# EAGLE design CAN-FD Shield (EAGLE 6.4)
DESCRIPTION: microOBD 200 OBD-II Module; HW_REV: 1.4; PCB_REV: C; PCB_SPEC1: Layer Count: 4; PCB_SPEC2: Size: 1.3" x 0.59"; PCB_SPEC3: Finish Thickness: 0.049" - 0.052"; PCB_SPEC4: Copper Weight: 1oz; TITLE: STM1120

## Sheet 1 of 2
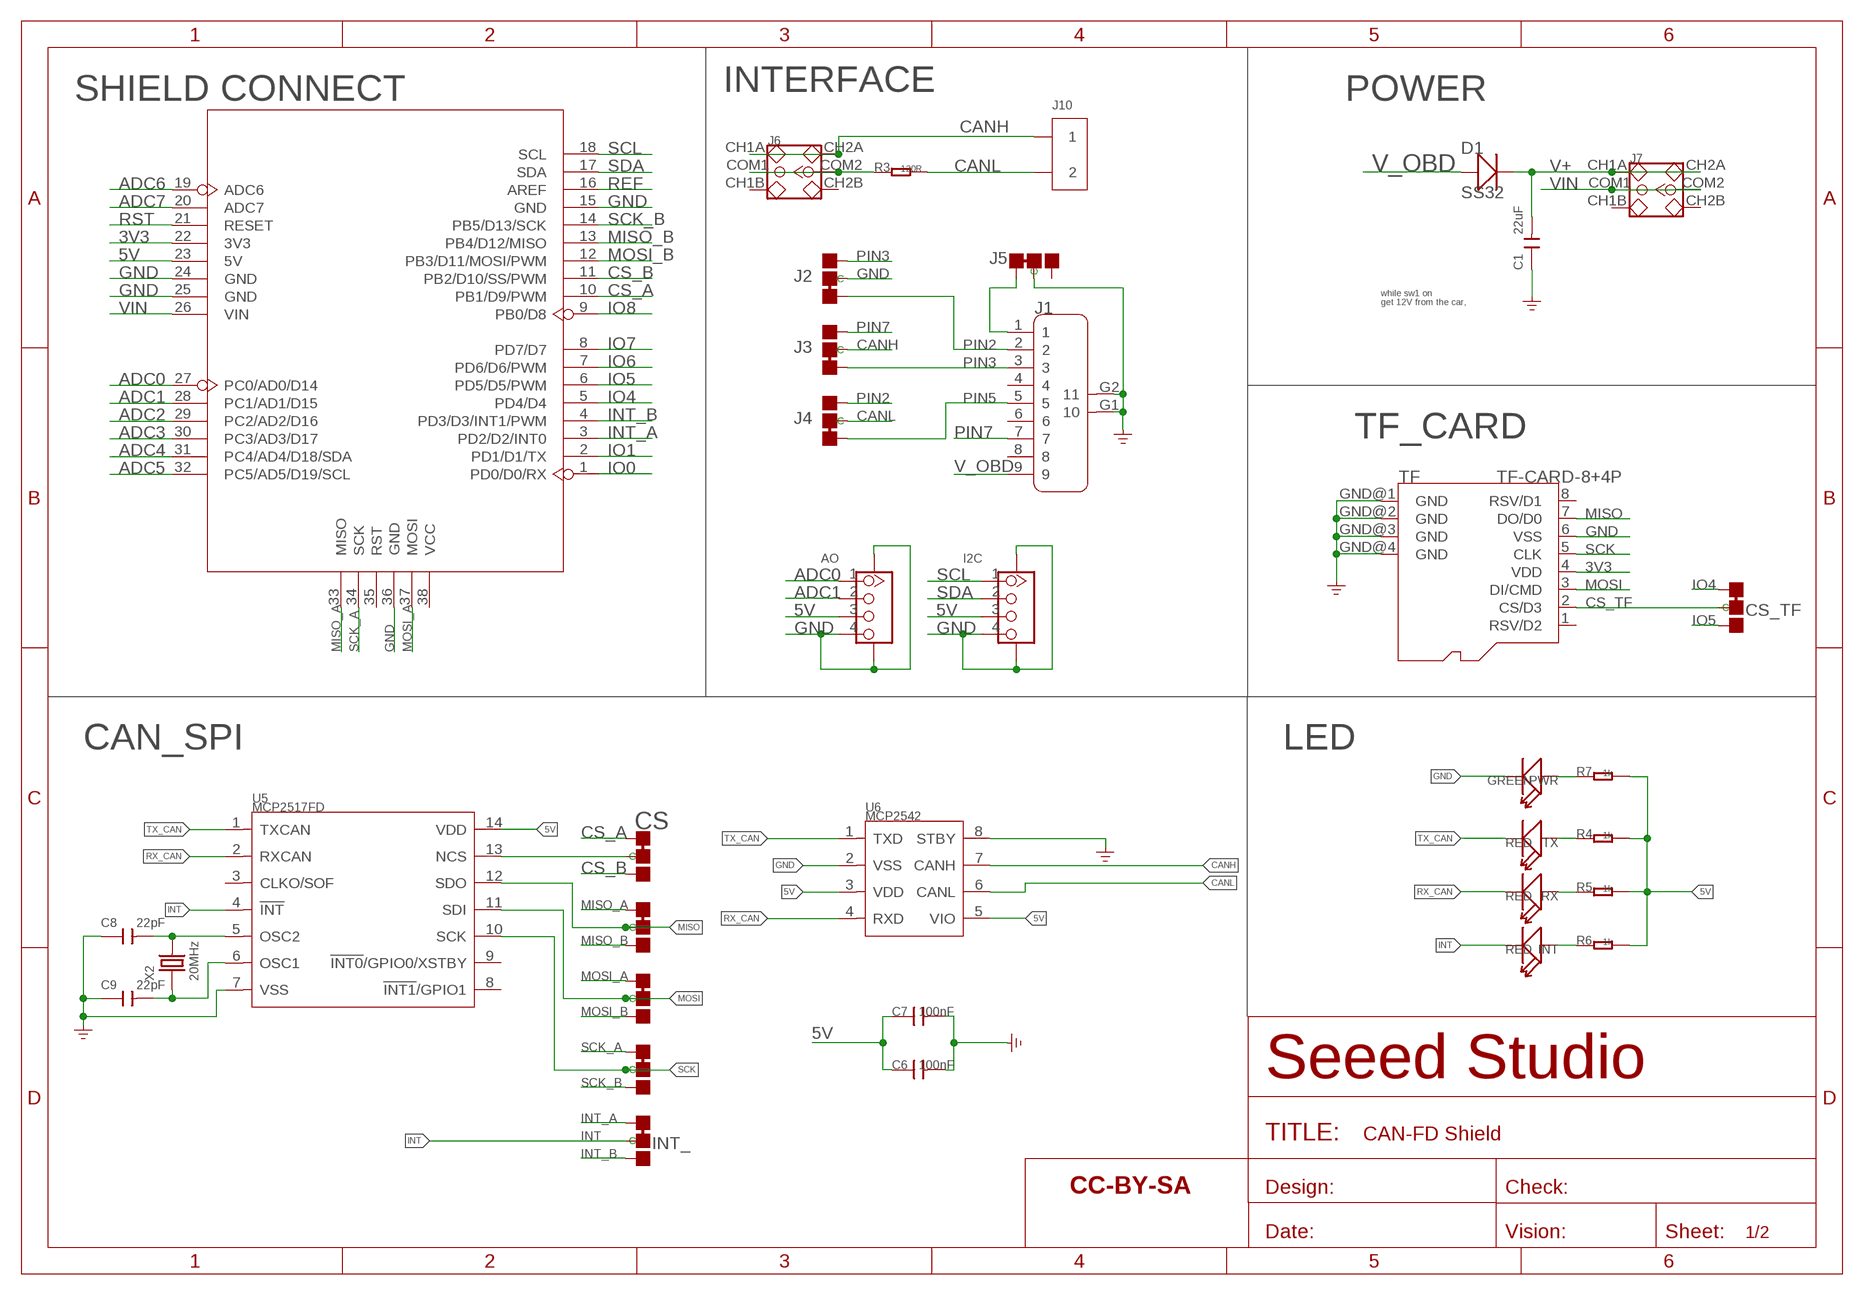
[diagram p0: schematic, sheet 1]

### Parts
AO  GROVE-CONNECTOR-SMD'90D'  [HW4-SMD-2.0-90D]
C1  22uF  CAP-1206  [C1206]
C6  100nF  C-0603  [0603]
C7  100nF  C-0603  [0603]
C8  22pF  CAP-0603  [C0603]
C9  22pF  CAP-0603  [C0603]
CS  JUMPER-3P-SHORT  [3P-SMD-SHORT]
CS_TF  JUMPER-3P-SHORT  [3P-SMD-SHORT]
D1  SS32  D-SMA  [D2010]
I2C  GROVE-CONNECTOR-SMD'90D'  [HW4-SMD-2.0-90D]
INT  RED  LED'0603'  [LED-0603]
INT_  JUMPER-3P-SHORT  [3P-SMD-SHORT]
J1  DB9'MEAL'  [DB9-MEAL]
J2  JUMPER-3P-SHORT  [3P-SMD-SHORT]
J3  JUMPER-3P-SHORT  [3P-SMD-SHORT]
J4  JUMPER-3P-SHORT  [3P-SMD-SHORT]
J5  JUMPER-3P-SHORT  [3P-SMD-SHORT]
J6  SWITCH-2CH-6P  [6P-2CH-2.54-7.6X3.0]
J7  SWITCH-2CH-6P  [6P-2CH-2.54-7.6X3.0]
J10  SCREW-TERMINAL-2P'5.08'  [H2-5.0-10.5X8.0MM]
MISO  JUMPER-3P-SHORT  [3P-SMD-SHORT]
MOSI  JUMPER-3P-SHORT  [3P-SMD-SHORT]
PWR  GREEN  LED'0603'  [LED-0603]
R3  120R  R-0603  [0603]
R4  1k  R-0603  [0603]
R5  1k  R-0603  [0603]
R6  1k  R-0603  [0603]
R7  1k  R-0603  [0603]
RX  RED  LED'0603'  [LED-0603]
SCK  JUMPER-3P-SHORT  [3P-SMD-SHORT]
TF  TF-CARD-8+4P  [TF-8+4P-1.1-13.5X15MM]
TX  RED  LED'0603'  [LED-0603]
U4  ARDUINO-38P'WITH/-SILK'  [ARDUINO-38P-WITH/-SILK-500519002]
U5  MCP2517FD  CONTROLLER-MCP2517FD  [SOIC14-1.27-8.6X3.9MM]
U6  MCP2542  TRANSCEIVER-MCP2542  [SOIC8-1.27-5X4MM]
U$5  SEEEDSTUDIO-OPEN-SCH-FRAME  [SEEEDSTUDIO-PCB-FRAME]
X2  20MHz  CRYSTAL-2P'HC49US'  [HC49US]

### Nets
3V3: TF.4(VDD) U4.22(3V3)
5V: AO.3 C6.1 C7.1 I2C.3 R4.2 R5.2 R6.2 R7.2 U4.23(5V) U5.14(VDD) U6.3(VDD) U6.5(VIO)
ADC0: AO.1 U4.27(PC0/AD0/D14)
ADC1: AO.2 U4.28(PC1/AD1/D15)
ADC2: U4.29(PC2/AD2/D16)
ADC3: U4.30(PC3/AD3/D17)
ADC4: U4.31(PC4/AD4/D18/SDA)
ADC5: U4.32(PC5/AD5/D19/SCL)
ADC6: U4.19(ADC6)
ADC7: U4.20(ADC7)
CANH: J3.MM(C) J6.CH1A J6.CH2A J10.1 U6.7(CANH)
CANL: J4.MM(C) J10.2 R3.2 U6.6(CANL)
CS_A: CS.11(L) U4.10(PB1/D9/PWM)
CS_B: CS.00(R) U4.11(PB2/D10/SS/PWM)
CS_TF: CS_TF.MM(C) TF.2(CS/D3)
GND: AO.4 AO.SS1 AO.SS2 C1.1 C6.2 C7.2 C8.1 C9.1 I2C.4 I2C.SS1 I2C.SS2 J1.G1 J1.G2 J2.MM(C) J5.MM(C) PWR.- TF.6(VSS) TF.GND@1(GND) TF.GND@2(GND) TF.GND@3(GND) TF.GND@4(GND) U4.15(GND) U4.24(GND) U4.25(GND) U4.36(GND) U5.7(VSS) U6.2(VSS) U6.8(STBY) ; supply symbol labelled GND_POWER
INT: INT.- INT_.MM(C) U5.4(!INT)
INT_A: INT_.11(L) U4.3(PD2/D2/INT0)
INT_B: INT_.00(R) U4.4(PD3/D3/INT1/PWM)
IO0: U4.1(PD0/D0/RX)
IO1: U4.2(PD1/D1/TX)
IO4: CS_TF.11(L) U4.5(PD4/D4)
IO5: CS_TF.00(R) U4.6(PD5/D5/PWM)
IO6: U4.7(PD6/D6/PWM)
IO7: U4.8(PD7/D7)
IO8: U4.9(PB0/D8)
MISO: MISO.MM(C) TF.7(DO/D0) U5.12(SDO)
MISO_A: MISO.11(L) U4.33(MISO)
MISO_B: MISO.00(R) U4.13(PB4/D12/MISO)
MOSI: MOSI.MM(C) TF.3(DI/CMD) U5.11(SDI)
MOSI_A: MOSI.11(L) U4.37(MOSI)
MOSI_B: MOSI.00(R) U4.12(PB3/D11/MOSI/PWM)
N$1: PWR.+ R7.1
N$2: R4.1 TX.+
N$3: J6.COM1 J6.COM2 R3.1
N$4: J1.1 J5.11(L)
N$7: C8.2 U5.5(OSC2) X2.2
N$13: CS.MM(C) U5.13(NCS)
N$15: R5.1 RX.+
N$18: C9.2 U5.6(OSC1) X2.1
N$19: INT.+ R6.1
PIN2: J1.2 J2.11(L) J4.00(R)
PIN3: J1.3 J2.00(R) J3.11(L)
PIN5: J1.5 J4.11(L)
PIN7: J1.7 J3.00(R)
REF: U4.16(AREF)
RST: U4.21(RESET)
RX_CAN: RX.- U5.2(RXCAN) U6.4(RXD)
SCK: SCK.MM(C) TF.5(CLK) U5.10(SCK)
SCK_A: SCK.11(L) U4.34(SCK)
SCK_B: SCK.00(R) U4.14(PB5/D13/SCK)
SCL: I2C.1 U4.18(SCL)
SDA: I2C.2 U4.17(SDA)
TX_CAN: TX.- U5.1(TXCAN) U6.1(TXD)
V+: C1.2 D1.- J7.CH1A J7.CH2A
V_OBD: D1.+ J1.9
VIN: J7.COM1 J7.COM2 U4.26(VIN)
Unconnected: J1.4 J1.6 J1.8 J5.00(R) J6.CH1B J6.CH2B J7.CH1B J7.CH2B TF.1(RSV/D2) TF.8(RSV/D1) U4.35(RST) U4.38(VCC) U5.3(CLKO/SOF) U5.8(!INT1!/GPIO1) U5.9(!INT0!/GPIO0/XSTBY)

### Notes on the sheet
- SHIELD CONNECT | INTERFACE | POWER
- while sw1 on
- get 12V from the car,
- TF_CARD
- CAN_SPI | LED

## Sheet 2 of 2

## Library data of the parts
AO I2C = Connector-new:GROVE-CONNECTOR-SMD: 4P-SMD-2.0:320110030;4P-SMD-2.0-90D:320110032
C1 C8 C9 = Discrete-new:CAP: Ceramic Capacitors
C6 C7 = Discrete:C*: Ceramic Capacitors
CS CS_TF INT_ J2-J5 MISO MOSI SCK = Discrete-new:JUMPER-3P-SHORT
D1 = Discrete:D*
INT PWR RX TX = Discrete:LED*
J1 = Connector:DB9
J6 J7 = Discrete:SWITCH-2CH-6P
J10 = Connector-new:SCREW-TERMINAL-2P: 2P-3.5:320110028;2P-5.0:320110031
R3-R7 = Discrete:R*
TF = Connector-new:TF-CARD-8+4P: http://garden.seeedstudio.com/images/e/e4/Flip_TF_Holder.jpg
U4 = moudle:ARDUINO-38P
U5 = untitled:CONTROLLER-MCP2517FD
U6 = untitled:TRANSCEIVER-MCP2542
U$5 = moudle-new:SEEEDSTUDIO-OPEN-SCH-FRAME
X2 = Discrete-new:CRYSTAL-2P

## Board
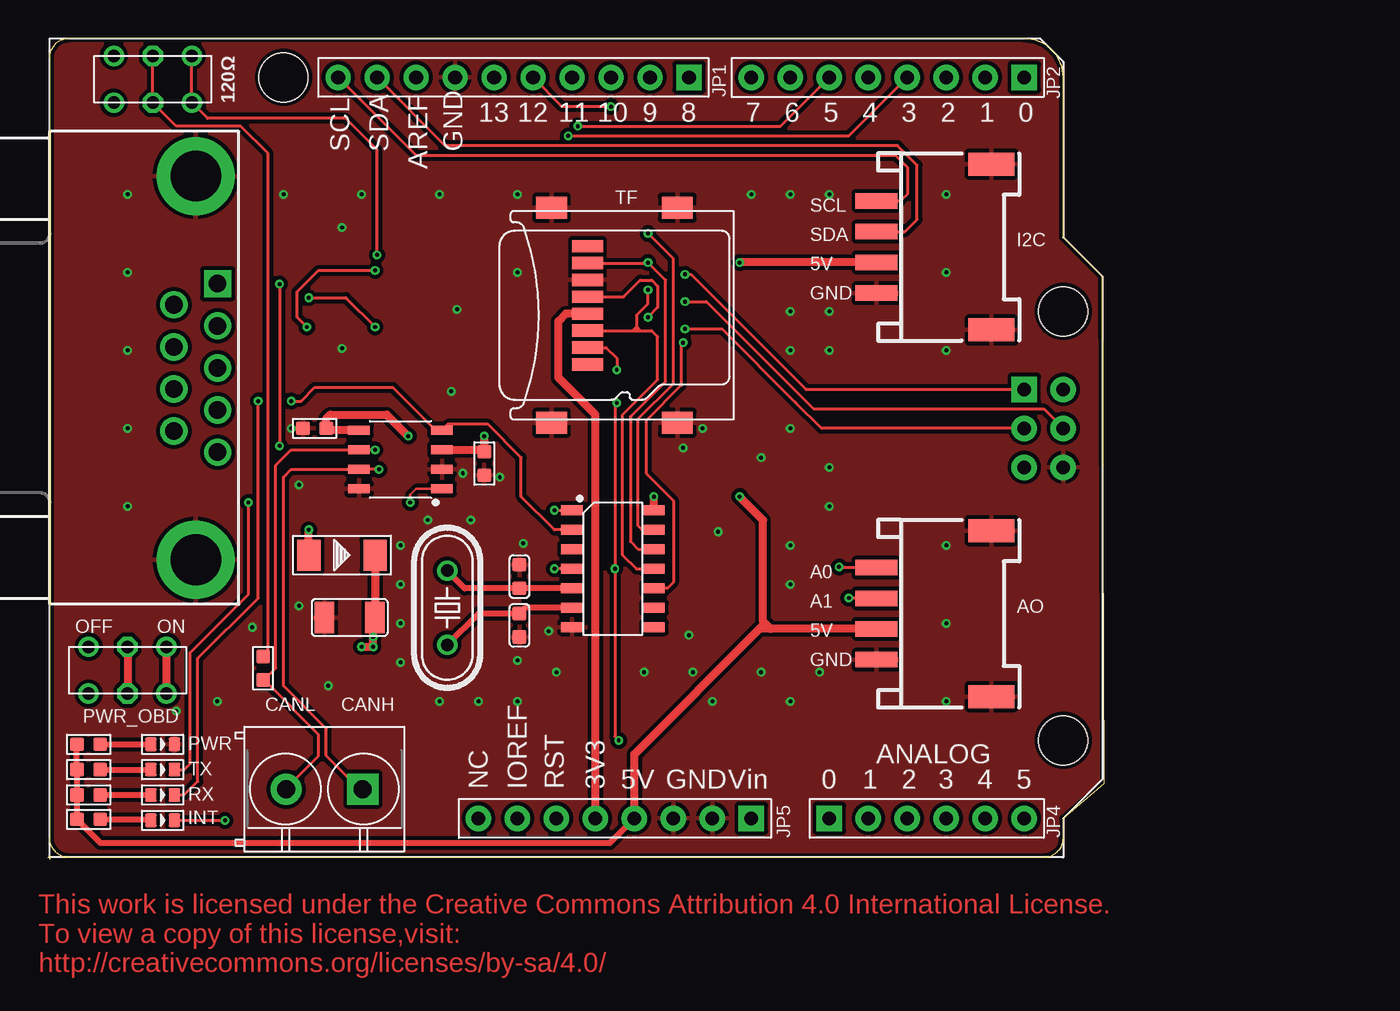
[diagram p1: board, top side]
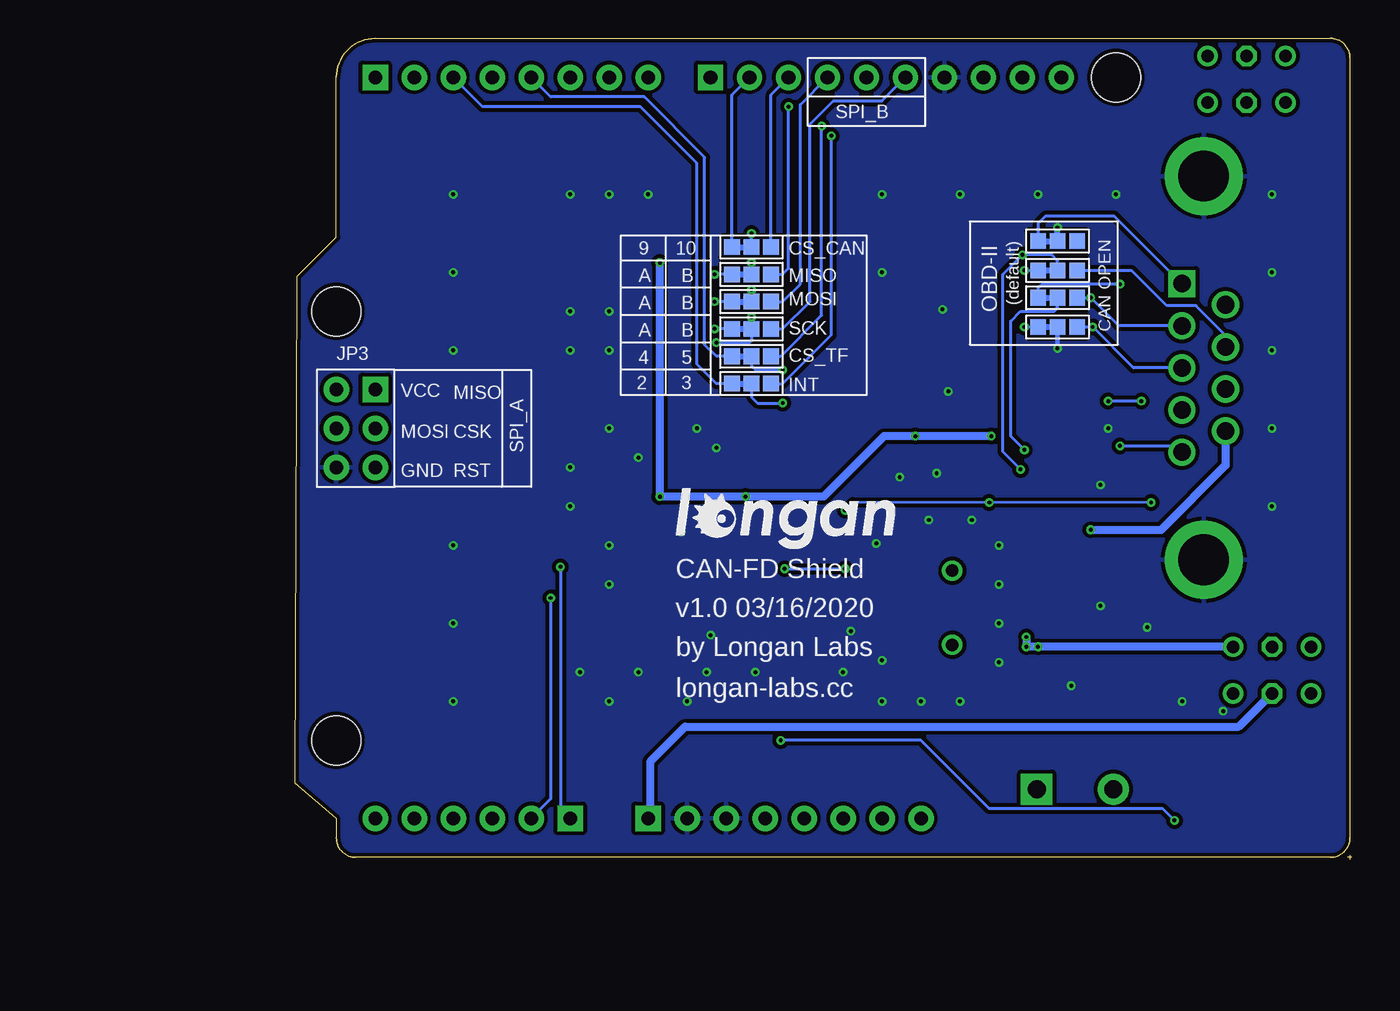
[diagram p2: board, bottom side, seen from below]

Size 68.83 x 53.47 mm. Coordinates in mm from the lower left corner, seen from the top.
Outline: 66.17,1.4 arc-90 64.9,0.13
Outline: 1.4,0.13 arc-90 0.13,1.4
Outline: 0.13,52.2 arc-90 1.4,53.47
Outline: 63.63,53.47 arc-90 66.17,50.93
Outline: 0.13,1.4 arc90 1.4,0.13
Outline: 64.9,0.13 arc90 66.17,1.4
Outline: 1.4,53.47 arc90 0.13,52.2
Outline: 0.13,1.4 arc90 1.4,0.13
Outline: 64.9,0.13 arc90 66.17,1.4
Outline: 66.17,50.93 arc90 63.63,53.47
Outline: 66.17,1.4 66.17,2.67 68.83,4.95 68.71,37.97 66.17,40.51 66.17,50.93
Outline: 66.17,1.4 arc-90 64.9,0.13
Outline: 63.63,53.47 1.4,53.47
Outline: 1.4,53.47 arc90 0.13,52.2
Outline: 0.13,52.2 0.13,1.4
Outline: 0.13,1.4 arc90 1.4,0.13
Outline: 66.17,50.93 arc90 63.63,53.47
Outline: 1.4,0.13 64.9,0.13
Outline: 0,0.13 0.25,0.13
Outline: 0.13,0.25 0.13,0
Copper layers (1*16): Top 0.035mm / dielectric 1.5mm / Bottom 0.035mm
Design rules "SeeedStudio_2layer_DRU_no_angle_20140221 *": minimum track width 6mil, minimum drill 10mil, track to track 6mil, track to pad 6mil, pad to pad 6mil, via to via 6mil, smd to smd 0mil, copper to edge 10mil, drill to drill 10mil, minimum pad ring 10mil, minimum via ring 6mil, stop-mask expansion 2mil, vias tented up to drill 25mil, thermal gap 10mil

### Footprints (pad centres in the part's own frame; a part is rotated, then mirrored left to right if it is on the bottom)
HW4-SMD-2.0-90D = smd 1.01 x 2.74: 1 -3,-0.1; 2 -1,-0.1; 3 1,-0.1; 4 3,-0.1 | smd 1.5 x 3: SS1 -5.4,7.4; SS2 5.4,7.4
C1206 = smd 1.27 x 2.032: 1 -1.651,0; 2 1.651,0
0603 = smd 0.889 x 0.889: 1 -0.762,0; 2 0.762,0
C0603 = smd 0.889 x 0.889: 1 -0.762,0; 2 0.762,0
3P-SMD-SHORT = smd 1.016 x 1.016: 00 -1.27,0; 11 1.27,0; MM 0,0
D2010 = smd 1.524 x 2.032: + -2.159,0; - 2.159,0
LED-0603 = smd 0.762 x 0.889: + -0.762,0; - 0.762,0
DB9-MEAL = drill 1.143 pad 1.778 square: 1 -5.486,1.422 | drill 1.143 pad 1.778: 2 -2.743,1.422; 3 0,1.422; 4 2.743,1.422; 5 5.486,1.422; 6 -4.115,-1.422; 7 -1.372,-1.422; 8 1.372,-1.422; 9 4.115,-1.422 | drill 3.302 pad 5.08: G1 12.497,0; G2 -12.497,0
6P-2CH-2.54-7.6X3.0 = drill 0.813 pad 1.27: CH1A -1.524,2.54; CH1B -1.524,-2.54; CH2A 1.524,2.54; CH2B 1.524,-2.54 | drill 0.813 pad 1.27 octagon: COM1 -1.524,0; COM2 1.524,0
H2-5.0-10.5X8.0MM = drill 1.168 pad 2.032 square: 1 0,2.5 | drill 1.168 pad 2.032: 2 0,-2.5
TF-8+4P-1.1-13.5X15MM = smd 0.8 x 2: 1 3.2,0.25; 2 2.1,0.25; 3 1,0.25; 4 -0.1,0.25; 5 -1.2,0.25; 6 -2.3,0.25; 7 -3.4,0.25; 8 -4.5,0.25 | smd 1.45 x 2: GND@1 -7,6.1; GND@2 -7,-2.1; GND@3 7,-2.1; GND@4 7,6.1
ARDUINO-38P-WITH/-SILK-500519002 = drill 0.889 pad 1.651 square: 1 63.5,50.8; 9 41.656,50.8; 26 45.72,2.54; 27 50.8,2.54; 33 63.5,30.48 | drill 0.889 pad 1.651: 2 60.96,50.8; 3 58.42,50.8; 4 55.88,50.8; 5 53.34,50.8; 6 50.8,50.8; 7 48.26,50.8; 8 45.72,50.8; 10 39.116,50.8; 11 36.576,50.8; 12 34.036,50.8; 13 31.496,50.8; 14 28.956,50.8; 15 26.416,50.8; 16 23.876,50.8; 17 21.336,50.8; 18 18.796,50.8; 19 27.94,2.54; 20 30.48,2.54; 21 33.02,2.54; 22 35.56,2.54; 23 38.1,2.54; 24 40.64,2.54; 25 43.18,2.54; 28 53.34,2.54; 29 55.88,2.54; 30 58.42,2.54; 31 60.96,2.54; 32 63.5,2.54; 34 63.5,27.94; 35 63.5,25.4; 36 66.04,25.4; 37 66.04,27.94; 38 66.04,30.48 | hole 3.2: 15.24,50.8; 66.04,35.56; 66.04,7.62
SOIC14-1.27-8.6X3.9MM = smd 0.635 x 1.397: 1 -3.81,-2.667; 2 -2.54,-2.667; 3 -1.27,-2.667; 4 0,-2.667; 5 1.27,-2.667; 6 2.54,-2.667; 7 3.81,-2.667; 8 3.81,2.667; 9 2.54,2.667; 10 1.27,2.667; 11 0,2.667; 12 -1.27,2.667; 13 -2.54,2.667; 14 -3.81,2.667
SOIC8-1.27-5X4MM = smd 0.6 x 1.4: 1 -1.905,-2.7; 2 -0.635,-2.7; 3 0.635,-2.7; 4 1.905,-2.7; 5 1.905,2.7; 6 0.635,2.7; 7 -0.635,2.7; 8 -1.905,2.7
HC49US = drill 0.813: 1 -2.413,0; 2 2.413,0

### Placement (x,y rotation side)
AO  54.1,16 270 top
C1  19.68,15.75 0 top
C6  28.45,25.78 270 top
C7  17.4,28.07 180 top
C8  30.73,18.41 270 top
C9  30.73,15.24 90 top
CS  39.12,39.88 180 bottom
CS_TF  39.12,32.77 180 bottom
D1  19.18,19.81 0 top
I2C  54.1,39.88 270 top
INT  7.49,2.54 0 top
INT_  39.12,30.99 180 bottom
J1  9.65,32 270 top
J2  19.18,34.67 180 bottom
J3  19.18,38.35 180 bottom
J4  19.18,36.58 180 bottom
J5  19.18,40.26 180 bottom
J6  6.86,50.8 270 top
J7  5.21,12.32 270 top
J10  18.03,4.57 270 top
MISO  39.12,38.1 180 bottom
MOSI  39.12,36.32 180 bottom
PWR  7.49,7.49 0 top
R3  14.03,12.45 270 top
R4  2.67,5.84 180 top
R5  2.67,4.19 180 top
R6  2.67,2.6 180 top
R7  2.67,7.49 180 top
RX  7.49,4.19 0 top
SCK  39.12,34.54 180 bottom
TF  34.93,35.43 270 top
TX  7.49,5.84 0 top
U4  0.13,0.13 0 top
U5  36.83,18.92 270 top
U6  22.99,26.04 90 top
U$1  [LONGAN-SILK-SMALLER]  45.34,19.05 0 bottom
U$5  -0.6,-7.37 0 top  (outside the outline)
X2  26.04,16.38 90 top

### Tracks (layer width: path | path; a pad name or v marks a point on that pad's centre or on a via)
3V3
  Top 0.508: U4.22 35.69,28.96 33.27,31.37 33.27,35.05 33.76,35.53 TF.4
5V  (via drill 0.25 pad 0.51)
  Top 0.254: R4.2 1.91,5.71
  Top 0.406: 1.91,5.71 R5.2 R6.2 3.43,1.08 36.64,1.08 U4.23 | R4.2 R7.2
  Top 0.508: I2C.3 45.1,38.88 v45.09,38.86 | 46.61,15.49 46.61,15.24 46.37,15 | 46.37,15 38.23,6.86 U4.23 | AO.3 47.1,15 | 47.1,15 46.37,15 | 47.1,15 46.61,15.49 | U6.5 18.29,27.94 C7.1 18.16,28.7 18.41,28.96 22.1,28.96 v23.49,27.56 | U6.3 28.32,26.67 C6.1 v28.45,27.56 | U5.14 v39.5,23.62 | 46.61,15.49 46.61,22.1 v45.09,23.62
  Bottom 0.508: v45.09,38.86 v45.09,23.62 v39.5,23.62 34.42,23.62 30.48,27.56 v28.45,27.56 v23.49,27.56
ADC0  (via drill 0.25 pad 0.51)
  Top 0.203: AO.1 51.61,19 v51.56,19.05
  Bottom 0.203: v51.56,19.05 51.56,3.3 U4.27
ADC1  (via drill 0.25 pad 0.51)
  Top 0.203: AO.2 52.21,17 v52.2,17.02
  Bottom 0.203: v52.2,17.02 52.2,3.94 U4.28
CANH  (via drill 0.25 pad 0.51)
  Top 0.203: J10.1 20.32,4.57 18.16,6.73 18.16,8.51 15.37,11.3 15.37,24.89 15.88,25.4 U6.7 | v21.46,39.37 21.46,46.23 19.43,48.26 10.41,48.26 J6.CH2A J6.CH1A | 20.16,25.53 U6.7 | v21.59,25.4 U6.7
  Bottom 0.203: J3.MM 19.18,38.99 19.56,39.37 v21.46,39.37 22.73,38.1 22.73,26.54 v21.59,25.4
CANL  (via drill 0.25 pad 0.51)
  Top 0.203: J10.2 15.53,4.61 17.65,6.73 17.65,8.13 14.1,11.68 | R3.2 14.1,11.68 | 14.1,11.68 14.86,12.45 14.86,25.65 15.88,26.67 U6.6 v21.34,26.67
  Bottom 0.203: J4.MM 19.18,35.94 19.43,35.69 21.59,35.69 22.22,35.05 22.22,27.56 v21.34,26.67
CS_A
  Bottom 0.203: CS.11 40.39,49.78 U4.10
CS_B
  Bottom 0.203: CS.00 37.85,49.78 U4.11
CS_TF  (via drill 0.25 pad 0.51)
  Top 0.203: TF.2 36.39,33.33 37.08,32.64 v37.08,31.88
  Bottom 0.203: CS_TF.MM 39.12,32.13 38.86,31.88 v37.08,31.88
GND  (via drill 0.25 pad 0.51)
  Bottom 0.305: J2.MM v19.18,33.27
  Bottom 0.406: J5.MM v19.18,41.15
  other vias: 16.38,16.51 8.38,9.65 46.48,26.16 33.15,12.19 38.86,12.19 42.04,12.19 46.48,12.19 50.29,12.19 41.4,26.8 42.67,28.07 5.21,22.99 5.21,28.07 5.21,33.15 5.21,38.23 5.21,43.31 15.37,43.31 20.45,43.31 25.53,43.31 30.61,43.31 30.61,38.23 22.99,17.91 22.99,15.37 22.99,12.83 22.99,20.45 25.53,10.29 28.07,10.29 30.61,10.29 48.39,10.29 43.31,10.29 48.39,17.91 48.39,20.45 50.93,22.99 48.39,28.07 48.39,33.15 50.93,33.15 48.39,35.69 50.93,35.69 58.55,10.29 58.55,15.37 58.55,20.45 50.93,25.53 58.55,33.15 58.55,38.23 58.55,43.31 50.93,43.31 48.39,43.31 45.85,43.31 15.88,28.07 16.38,24.38 27.05,25.15 29.46,24.89 30.99,20.57 27.56,22.1 24.77,22.1 30.61,12.95 32.64,14.86 43.69,21.34 41.78,14.61 26.29,30.48 26.67,35.81 18.29,11.3 11.05,10.29 13.34,15.11
  pour Top (isolate 0.254, rank 6): -0.51,54.1 69.34,54.1 69.34,6.98 69.34,-0.51 61.72,-0.51 -0.51,-0.51
  pour Bottom (isolate 0.254, rank 6): -0.51,54.1 69.34,54.1 69.34,6.98 69.34,-0.51 61.72,-0.51 -0.51,-0.51
INT  (via drill 0.25 pad 0.51)
  Top 0.203: INT.- v11.56,2.54 | v37.08,29.72 36.96,29.59 v36.96,18.92 36.96,8 v37.21,7.75 | U5.4 v33.02,18.92
  Bottom 0.203: INT_.MM 39.12,30.1 38.73,29.72 v37.08,29.72 | v11.56,2.54 12.32,3.3 23.62,3.3 28.07,7.75 v37.21,7.75 | v36.96,18.92 v33.02,18.92
INT_A
  Bottom 0.203: INT_.11 41.4,30.99 42.67,32.26 42.67,45.34 46.36,49.02 56.64,49.02 U4.3
INT_B  (via drill 0.25 pad 0.51)
  Top 0.203: v33.91,47.12 52.2,47.12 U4.4
  Bottom 0.203: INT_.00 37.08,30.99 33.91,34.16 v33.91,47.12
IO4
  Bottom 0.203: CS_TF.11 41.4,32.77 42.16,33.53 42.16,45.72 46.1,49.66 52.2,49.66 U4.5
IO5  (via drill 0.25 pad 0.51)
  Top 0.203: v34.54,47.75 47.75,47.75 U4.6
  Bottom 0.203: CS_TF.00 37.21,32.77 34.54,35.43 v34.54,47.75
MISO  (via drill 0.25 pad 0.51)
  Top 0.203: TF.7 39.09,38.83 v39.12,38.86 40.26,37.72 40.26,31.11 37.97,28.83 37.97,20.7 38.48,20.19 U5.12
  Bottom 0.203: MISO.MM v39.12,38.86
MISO_A  (via drill 0.25 pad 0.51)
  Top 0.203: v41.53,38.1 41.91,38.1 49.4,30.61 U4.33
  Bottom 0.203: MISO.11 v41.53,38.1
MISO_B  (via drill 0.25 pad 0.51)
  Top 0.203: v36.7,49.02 33.53,49.02 U4.13
  Bottom 0.203: MISO.00 37.08,38.1 36.7,38.48 v36.7,49.02
MOSI  (via drill 0.25 pad 0.51)
  Top 0.203: TF.3 38.12,34.43 | 38.12,34.43 38.35,34.43 | 38.35,34.43 38.59,34.43 | 38.59,34.43 39.35,34.43 39.75,34.04 39.75,31.24 37.47,28.96 37.47,19.81 38.35,18.92 U5.11 | v39.12,37.08 39.12,36.2 38.35,35.43 38.35,34.67 | 38.35,34.67 38.35,34.43 | 38.12,34.43 38.35,34.67 | 38.59,34.43 38.35,34.67
  Bottom 0.203: MOSI.MM v39.12,37.08
MOSI_A  (via drill 0.25 pad 0.51)
  Top 0.203: v41.53,36.32 42.93,36.32 49.91,29.34 64.9,29.34 U4.37
  Bottom 0.203: MOSI.11 v41.53,36.32
MOSI_B
  Bottom 0.203: U4.12 35.94,49.15 35.94,37.47 36.89,36.51 37.08,36.32 MOSI.00
N$1
  Top 0.406: R7.1 PWR.+
N$2
  Top 0.406: R4.1 TX.+
N$3
  Top 0.203: R3.1 14.03,13.27 14.35,13.59 14.35,45.97 12.57,47.75 8.38,47.75 J6.COM2 J6.COM1
N$4
  Bottom 0.203: J5.11 20.45,41.4 19.94,41.91 15.49,41.91 J1.1
N$7
  Top 0.406: U5.5 C8.2 27.18,17.65 X2.2
N$13  (via drill 0.25 pad 0.51)
  Top 0.203: v39.12,40.77 40.77,39.12 40.77,30.99 38.48,28.7 38.48,21.72 38.73,21.46 U5.13
  Bottom 0.203: CS.MM v39.12,40.77
N$15
  Top 0.406: R5.1 RX.+
N$18
  Top 0.406: U5.6 31.11,16.38 C9.2 28.07,16 X2.1
N$19
  Top 0.406: R6.1 6.67,2.6 INT.+
PIN2  (via drill 0.25 pad 0.51)
  Top 0.203: v17.02,36.58 19.43,36.58 v21.34,34.67
  Bottom 0.203: J4.00 v17.02,36.58 15.19,34.75 J1.2 | v21.34,34.67 J2.11
PIN3  (via drill 0.25 pad 0.51)
  Top 0.203: v21.34,38.35 17.65,38.35 16.26,36.96 16.26,35.31 v16.89,34.67
  Bottom 0.203: J2.00 v16.89,34.67 14.22,32 J1.3 | v21.34,38.35 J3.11
PIN5  (via drill 0.25 pad 0.51)
  Top 0.203: v15.11,37.47 v15.11,26.92
  Bottom 0.203: v15.11,37.47 20.19,37.47 20.45,37.21 J4.11 | v15.11,26.92 11.48,26.92 J1.5
PIN7
  Bottom 0.203: J3.00 14.35,38.35 12.07,36.07 10.16,36.07 8.23,34.14 J1.7
RX_CAN  (via drill 0.25 pad 0.51)
  Top 0.203: RX.- 8.89,4.19 9.78,5.08 9.78,13.08 13.72,17.02 v13.72,29.84 | U5.2 33.02,21.46 30.86,23.62 30.86,26.16 28.7,28.32 26.07,28.32 U6.4 25.27,27.94 22.48,30.73 17.4,30.73 16.51,29.84 v15.88,29.84
  Bottom 0.203: v13.72,29.84 v15.88,29.84
SCK  (via drill 0.25 pad 0.51)
  Top 0.203: TF.5 37.52,36.63 38.61,37.72 39.37,37.72 39.75,37.34 39.75,35.94 v39.12,35.31 | v41.4,33.66 41.28,33.53 41.28,30.86 38.99,28.57 38.99,25.15 40.77,23.37 40.77,18.03 40.39,17.65 U5.10
  Bottom 0.203: v39.12,35.31 SCK.MM 39.12,33.78 39.24,33.66 v41.4,33.66
SCK_A  (via drill 0.25 pad 0.51)
  Top 0.203: v41.53,34.54 43.94,34.54 48.71,29.78 48.77,29.72 50.42,28.07 U4.34
  Bottom 0.203: SCK.11 v41.53,34.54
SCK_B
  Bottom 0.203: SCK.00 37.08,34.54 35.31,36.32 35.31,47.88 33.78,49.4 30.61,49.4 U4.14
SCL
  Top 0.203: U4.18 24,45.85 55.25,45.85 56.01,45.09 56.01,43.31 55.58,42.88 I2C.1
SDA
  Top 0.203: U4.17 25.91,46.48 55.37,46.48 56.64,45.21 56.64,41.66 55.86,40.88 I2C.2
TX_CAN  (via drill 0.25 pad 0.51)
  Top 0.152: U6.1 24,24.13 23.62,23.75 v23.62,23.24
  Top 0.203: TX.- 8.89,5.84 9.27,6.22 9.27,13.46 13.08,17.27 v13.08,23.24 | v33.02,22.73 U5.1
  Bottom 0.152: v13.08,23.24 v23.62,23.24 32.51,23.24
  Bottom 0.203: 32.51,23.24 v33.02,22.73
V+  (via drill 0.25 pad 0.51)
  Top 0.508: J7.CH2A J7.CH1A | D1.- C1.2 | C1.2 21.34,15.49 | C1.2 21.21,15.62 v21.21,13.84 v20.45,13.84
  Bottom 0.508: J7.CH1A v21.21,13.84 v21.21,14.48
V_OBD  (via drill 0.25 pad 0.51)
  Top 0.508: D1.+ v17.02,21.46
  Bottom 0.508: J1.9 8.23,25.65 12.42,21.46 v17.02,21.46
VIN
  Top 0.508: J7.COM1 J7.COM2
  Bottom 0.508: J7.COM2 7.37,8.64 43.43,8.64 45.72,6.35 45.72,2.79 U4.26

### Text on the board
tPlace: 120Ω | TF | SCL | SDA | 5V | GND | A0 | A1 | OFF | ON | 5V | GND | CANL | CANH | PWR_OBD
bPlace: SPI_B | CAN OPEN | (default) | OBD-II | CS_CAN | 10 | 9 | B | A | B | A | B | A | 5 | 4 | INT | 3 | 2 | SPI_A | MISO | VCC | CSK | MOSI | RST | GND | CAN-FD Shield | v1.0 03/16/2020 | by Longan Labs | longan-labs.cc